# Altium schematic sheet Distance Sensors.SchDoc
size A4
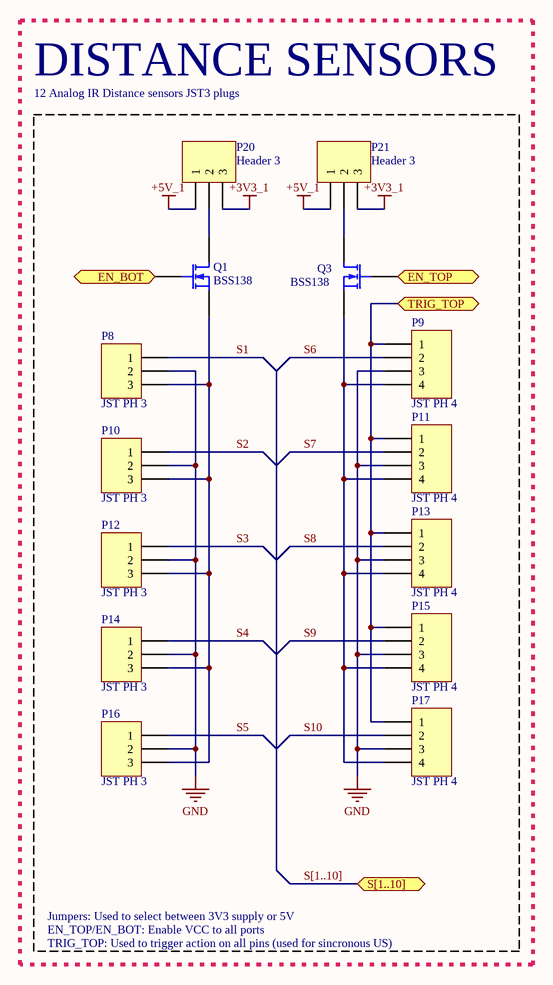
[diagram p0: Distance Sensors.SchDoc]

## Parts
P8  JST PH 3  [B3B-PH-K]
P9  JST PH 4  [B4B-PH-K]
P10  JST PH 3  [B3B-PH-K]
P11  JST PH 4  [B4B-PH-K]
P12  JST PH 3  [B3B-PH-K]
P13  JST PH 4  [B4B-PH-K]
P14  JST PH 3  [B3B-PH-K]
P15  JST PH 4  [B4B-PH-K]
P16  JST PH 3  [B3B-PH-K]
P17  JST PH 4  [B4B-PH-K]
P20  Header 3  [HDR1X3]
P21  Header 3  [HDR1X3]
Q1  BSS138  [SOT23]
Q3  BSS138  [SOT23]

## Ports
EN_BOT, EN_TOP, S[1..10], TRIG_TOP

## Nets
+3V3_1: P20.3 P21.3
+5V_1: P20.1 P21.1
GND: P8.2 P9.3 P10.2 P11.3 P12.2 P13.3 P14.2 P15.3 P16.2 P17.3
EN_BOT: Q1.3(G) ; port EN_BOT
EN_TOP: Q3.3(G) ; port EN_TOP
S1: P8.1
S2: P10.1
S3: P12.1
S4: P14.1
S5: P16.1
S6: P9.2
S7: P11.2
S8: P13.2
S9: P15.2
S10: P17.2
TRIG_TOP: P9.1 P11.1 P13.1 P15.1 P17.1 ; port TRIG_TOP
NetP8_3: P8.3 P10.3 P12.3 P14.3 P16.3 Q1.2(S)
NetP9_4: P9.4 P11.4 P13.4 P15.4 P17.4 Q3.2(S)
NetP20_2: P20.2 Q1.1(D)
NetP21_2: P21.2 Q3.1(D)

## Buses and harness runs
bus S[1..10] = port S[1..10]

## Notes on the sheet
- DISTANCE SENSORS
- 12 Analog IR Distance sensors JST3 plugs
- EN_TOP/EN_BOT: Enable VCC to all ports
- TRIG_TOP: Used to trigger action on all pins (used for sincronous US)
- Jumpers: Used to select between 3V3 supply or 5V

## Library data of the parts
P20 P21 = Header 3: Header, 3-Pin; LatestRevisionDate: 17-Jul-2002; LatestRevisionNote: Re-released for DXP Platform.; Publisher: Altium Limited
Q1 Q3 = BSS138: N-Channel Enhancement Mode Vertical DMOS FET; Published: 17-Dec-2003; DatasheetVersion: Mar-96; PackageVersion: 1996; PackageReference: SOT23; Publisher: Altium Limited; PackageDescription: SOT-23; 3 Leads; Body 3.1 x 2.5 mm, inc. leads (LxW max), Alternate Lead Configuration; ComponentLink1Description: Manufacturer Link; ComponentLink1URL: http://www.zetex.com/; ComponentLink2Description: Datasheet; ComponentLink2URL: www.zetex.com/3.0/pdf/BSS138.pdf